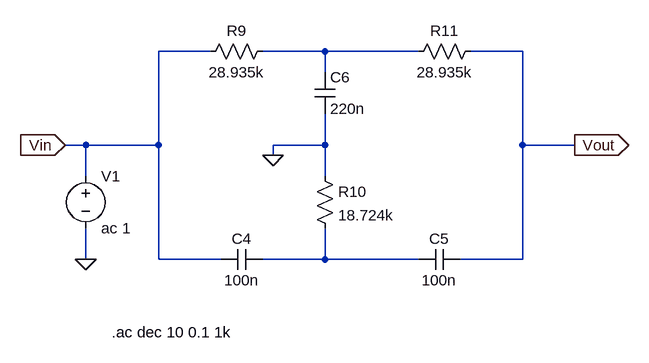
[diagram p0: schematic Notch Filter.asc]
Notch Filter.asc, the LTspice schematic file:
Version 4
SHEET 1 1056 680
WIRE 384 80 304 80
WIRE 560 80 464 80
WIRE 704 80 560 80
WIRE 864 80 784 80
WIRE 560 112 560 80
WIRE 192 224 160 224
WIRE 304 224 304 80
WIRE 304 224 192 224
WIRE 560 224 560 176
WIRE 560 224 480 224
WIRE 864 224 864 80
WIRE 944 224 864 224
WIRE 480 240 480 224
WIRE 192 272 192 224
WIRE 560 272 560 224
WIRE 192 400 192 352
WIRE 304 400 304 224
WIRE 400 400 304 400
WIRE 560 400 560 352
WIRE 560 400 464 400
WIRE 704 400 560 400
WIRE 864 400 864 224
WIRE 864 400 768 400
FLAG 192 400 0
FLAG 480 240 0
FLAG 944 224 Vout
IOPIN 944 224 Out
FLAG 160 224 Vin
IOPIN 160 224 In
SYMBOL Voltage 192 256 R0
SYMATTR InstName V1
SYMATTR Value ac 1
SYMBOL res 480 64 R90
WINDOW 0 0 56 VBottom 2
WINDOW 3 32 56 VTop 2
SYMATTR InstName R9
SYMATTR Value 28.935k
SYMBOL cap 544 112 R0
SYMATTR InstName C6
SYMATTR Value 220n
SYMBOL res 544 256 R0
SYMATTR InstName R10
SYMATTR Value 18.724k
SYMBOL cap 400 416 R270
WINDOW 0 32 32 VTop 2
WINDOW 3 0 32 VBottom 2
SYMATTR InstName C4
SYMATTR Value 100n
SYMBOL cap 704 416 R270
WINDOW 0 32 32 VTop 2
WINDOW 3 0 32 VBottom 2
SYMATTR InstName C5
SYMATTR Value 100n
SYMBOL res 800 64 R90
WINDOW 0 0 56 VBottom 2
WINDOW 3 32 56 VTop 2
SYMATTR InstName R11
SYMATTR Value 28.935k
TEXT 232 512 Left 2 !.ac dec 10 0.1 1k

The netlist it stands for:
* Notch Filter.asc
V1 Vin 0 ac 1
R9 N001 Vin 28.935k
C6 N001 0 220n
R10 0 N002 18.724k
C4 Vin N002 100n
C5 N002 Vout 100n
R11 Vout N001 28.935k
.ac dec 10 0.1 1k
.backanno
.end